# EAGLE design pedalier (EAGLE 6.5.0)

## Sheet 1 of 5
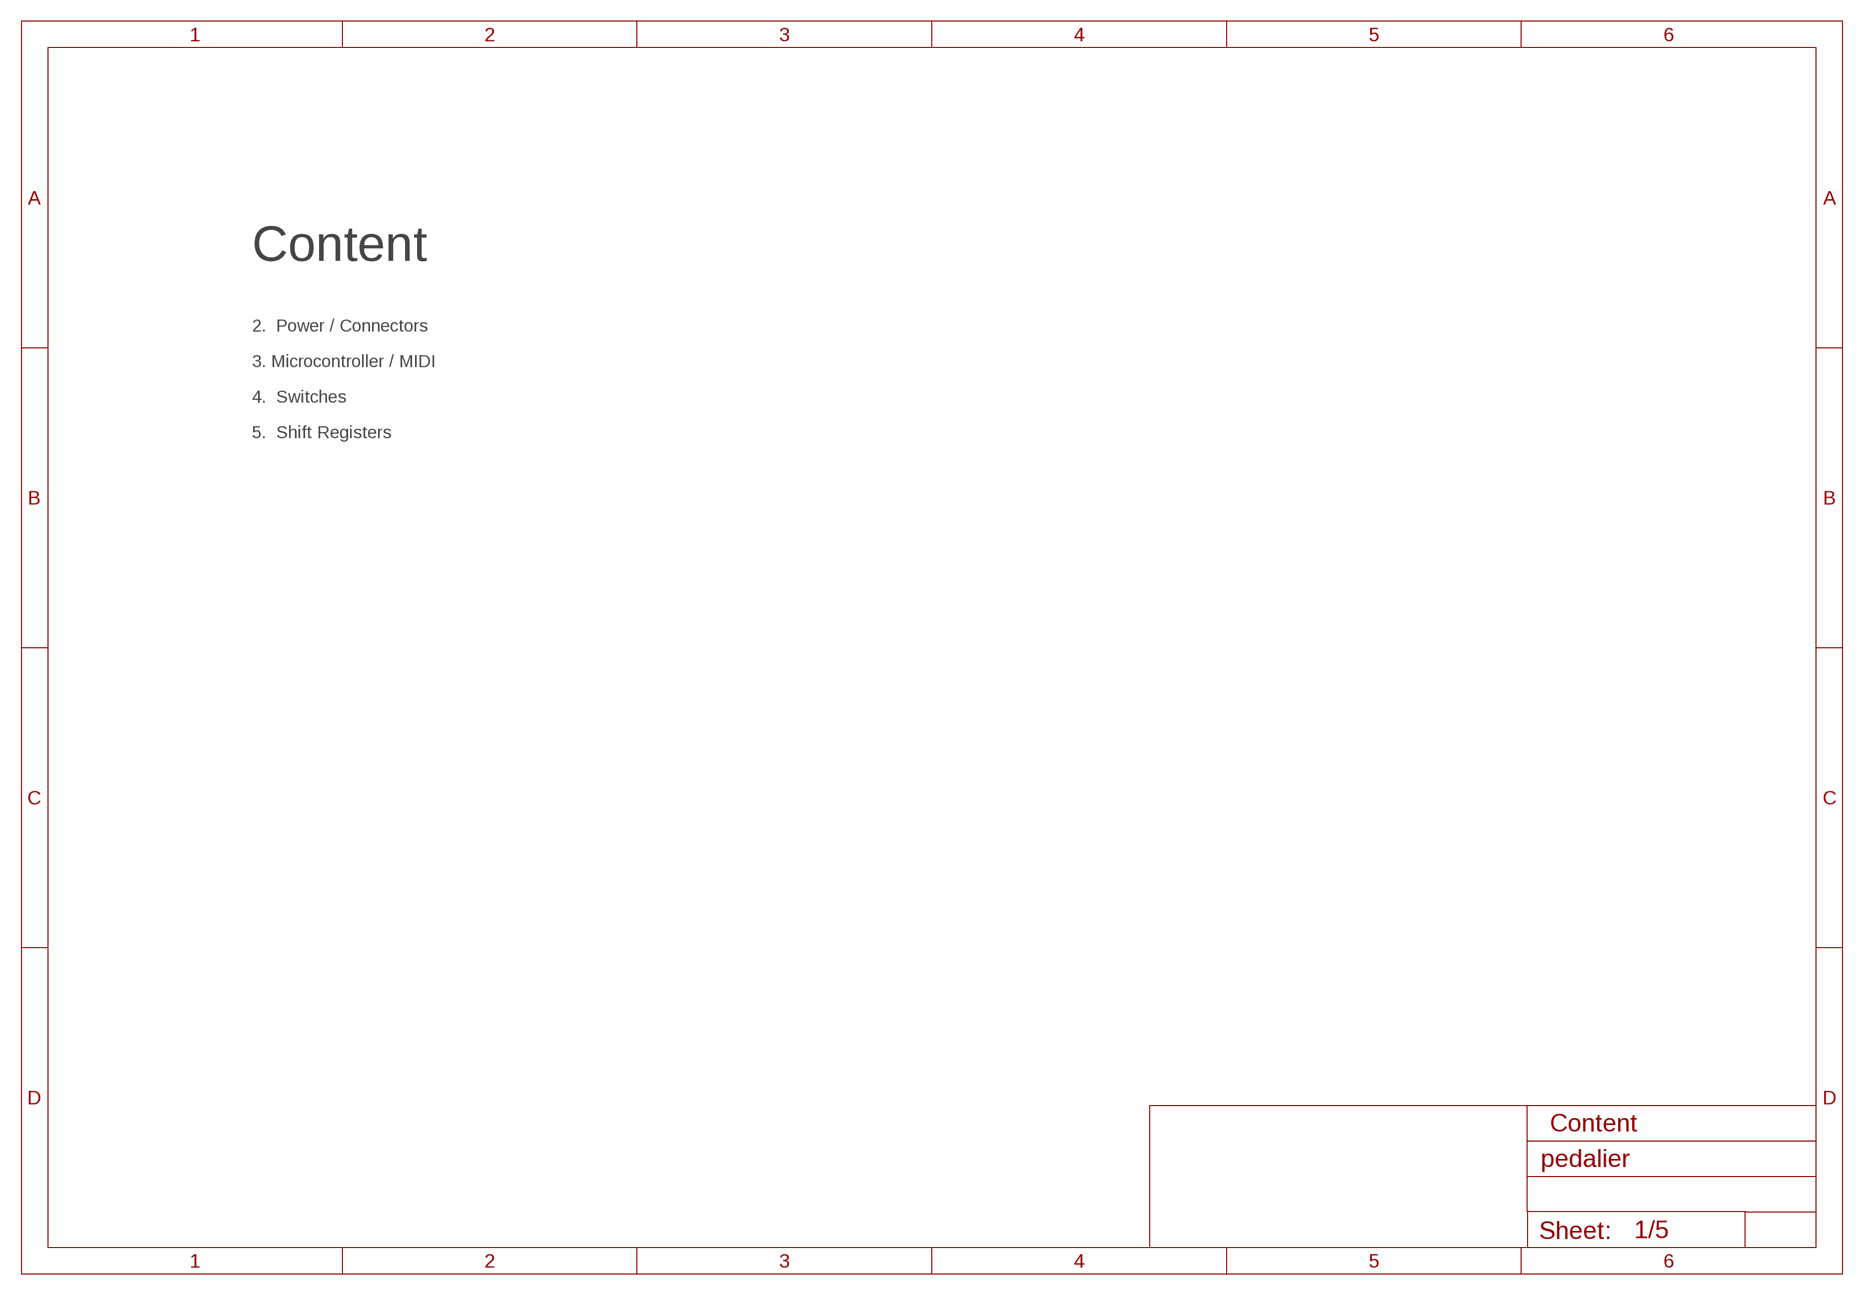
[diagram p0: schematic, sheet 1]

### Notes on the sheet
- Content
- 2.  Power / Connectors
- 3. Microcontroller / MIDI
- 4.  Switches
- 5.  Shift Registers
- Content

## Sheet 2 of 5
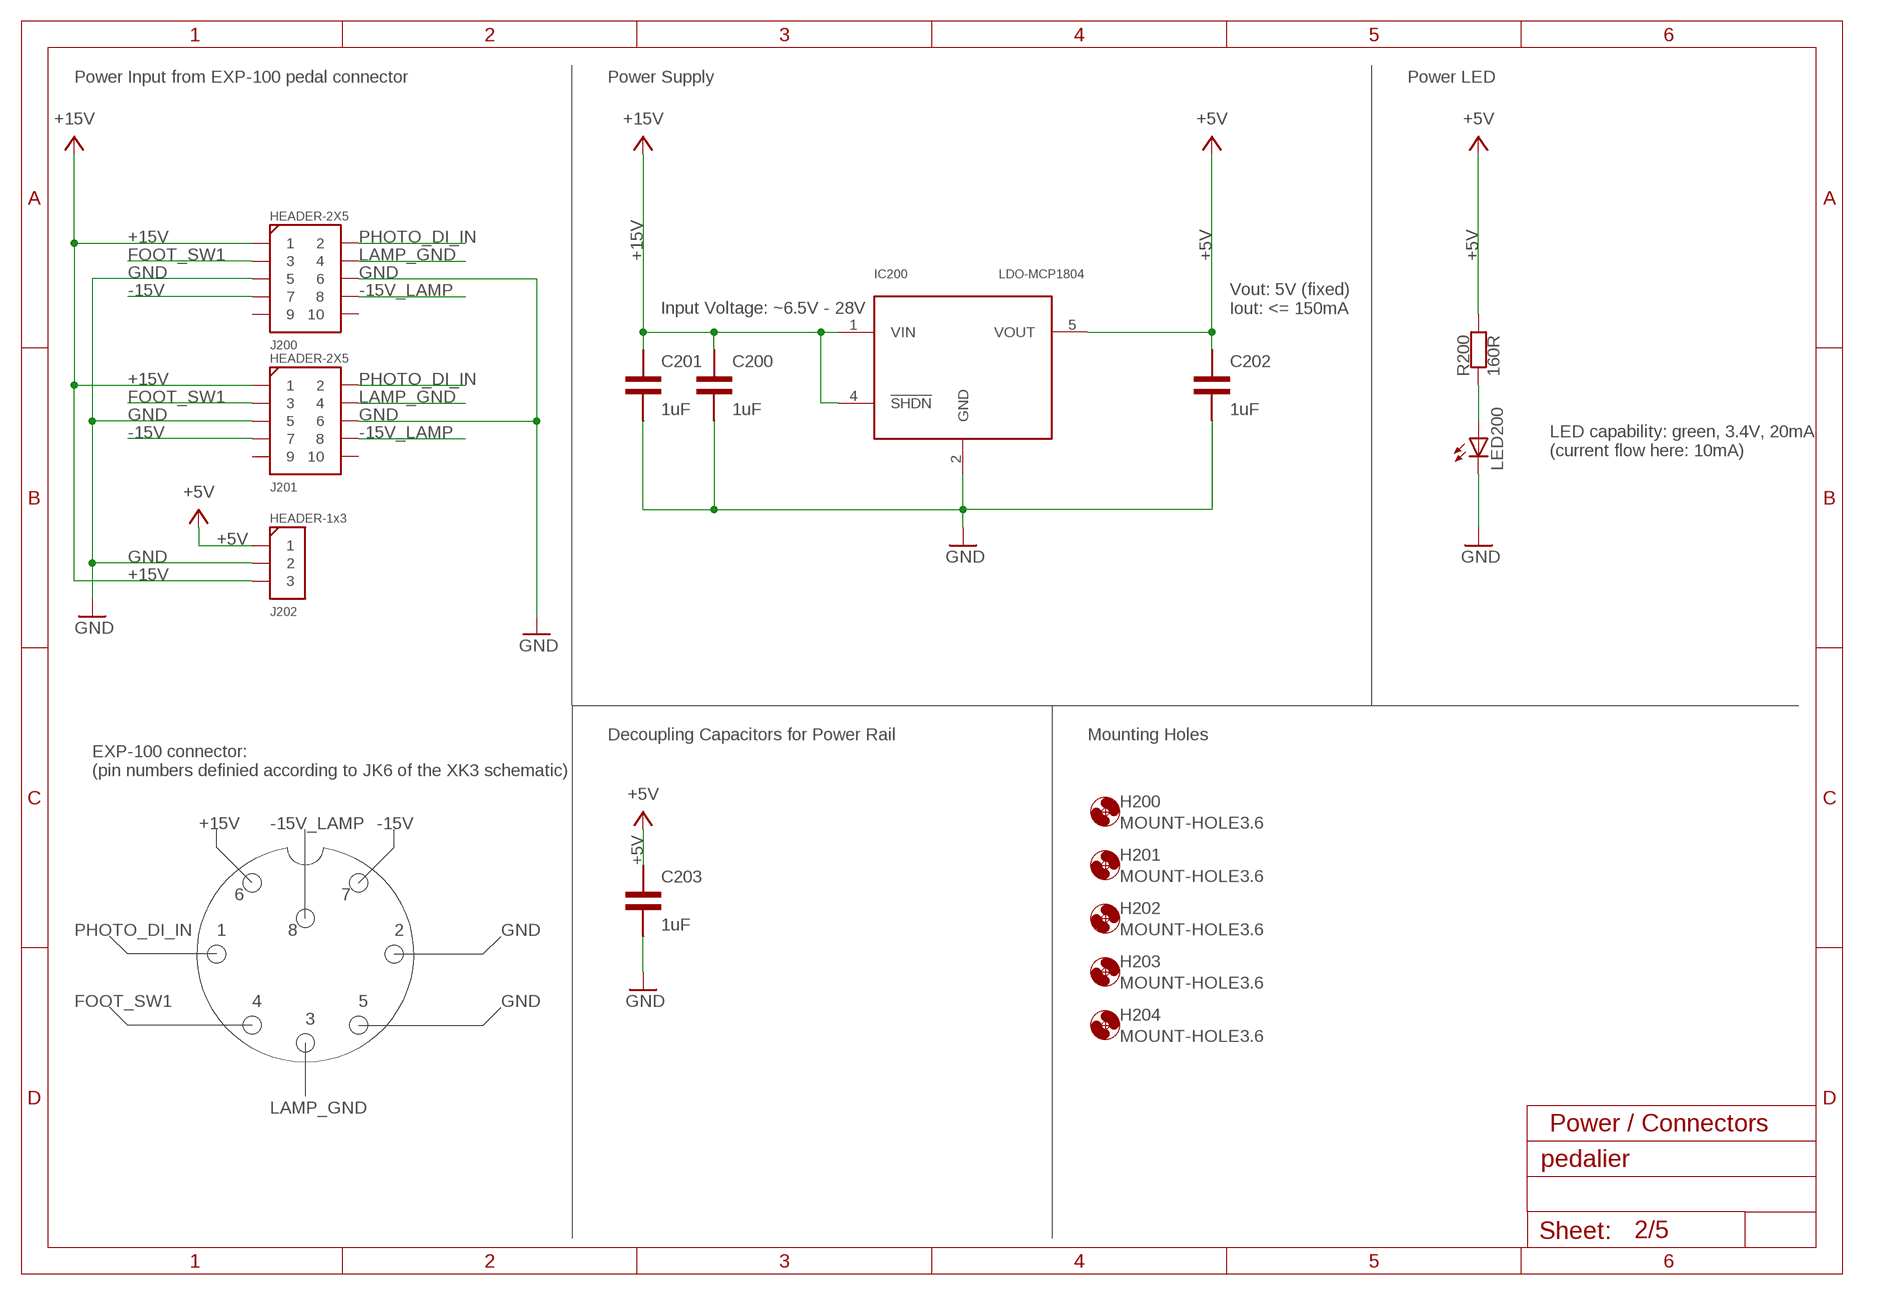
[diagram p1: schematic, sheet 2]

### Parts
C200  1uF  C  [C1206]
C201  1uF  C  [C1206]
C202  1uF  C  [C1206]
C203  1uF  C  [C1206]
H200  MOUNT-HOLE3.6  [3,6]
H201  MOUNT-HOLE3.6  [3,6]
H202  MOUNT-HOLE3.6  [3,6]
H203  MOUNT-HOLE3.6  [3,6]
H204  MOUNT-HOLE3.6  [3,6]
IC200  LDO-MCP1804  [SOT23-5]
J200  HEADER-2X5  [HEADER-2X5]
J201  HEADER-2X5  [HEADER-2X5]
J202  HEADER-1X3  [HEADER-1X3]
LED200  LED-BRIGHTEK  [LED1206]
R200  160R  R  [R1206]

### Nets
+5V: C202.1 C203.1 IC200.5(VOUT) J202.P$1 R200.2 ; also sheet 3,4,5
+15V [power2]: C200.1 C201.1 IC200.1(VIN) IC200.4(!SHDN) J200.P$1 J201.P$1 J202.P$3
-15V: J200.P$7 J201.P$7
-15V_LAMP: J200.P$8 J201.P$8
FOOT_SW1: J200.P$3 J201.P$3
GND: C200.2 C201.2 C202.2 C203.2 IC200.2(GND) J200.P$5 J200.P$6 J201.P$5 J201.P$6 J202.P$2 LED200.P$1(C) ; also sheet 3,4,5
LAMP_GND: J200.P$4 J201.P$4
N$1: LED200.P$2(A) R200.1
PHOTO_DI_IN: J200.P$2 J201.P$2
Unconnected: J200.P$9 J200.P$10 J201.P$9 J201.P$10

### Notes on the sheet
- Power Input from EXP-100 pedal connector | Power Supply | Power LED
- Input Voltage: ~6.5V - 28V
- Vout: 5V (fixed)
  Iout: <= 150mA
- LED capability: green, 3.4V, 20mA
  (current flow here: 10mA)
- Decoupling Capacitors for Power Rail | Mounting Holes
- EXP-100 connector:
  (pin numbers definied according to JK6 of the XK3 schematic)
- +15V | -15V_LAMP | -15V
- 6 | 7
- PHOTO_DI_IN | 1 | 8 | 2 | GND
- FOOT_SW1 | 4 | 5 | GND
- 3
- LAMP_GND
- Power / Connectors

## Sheet 3 of 5
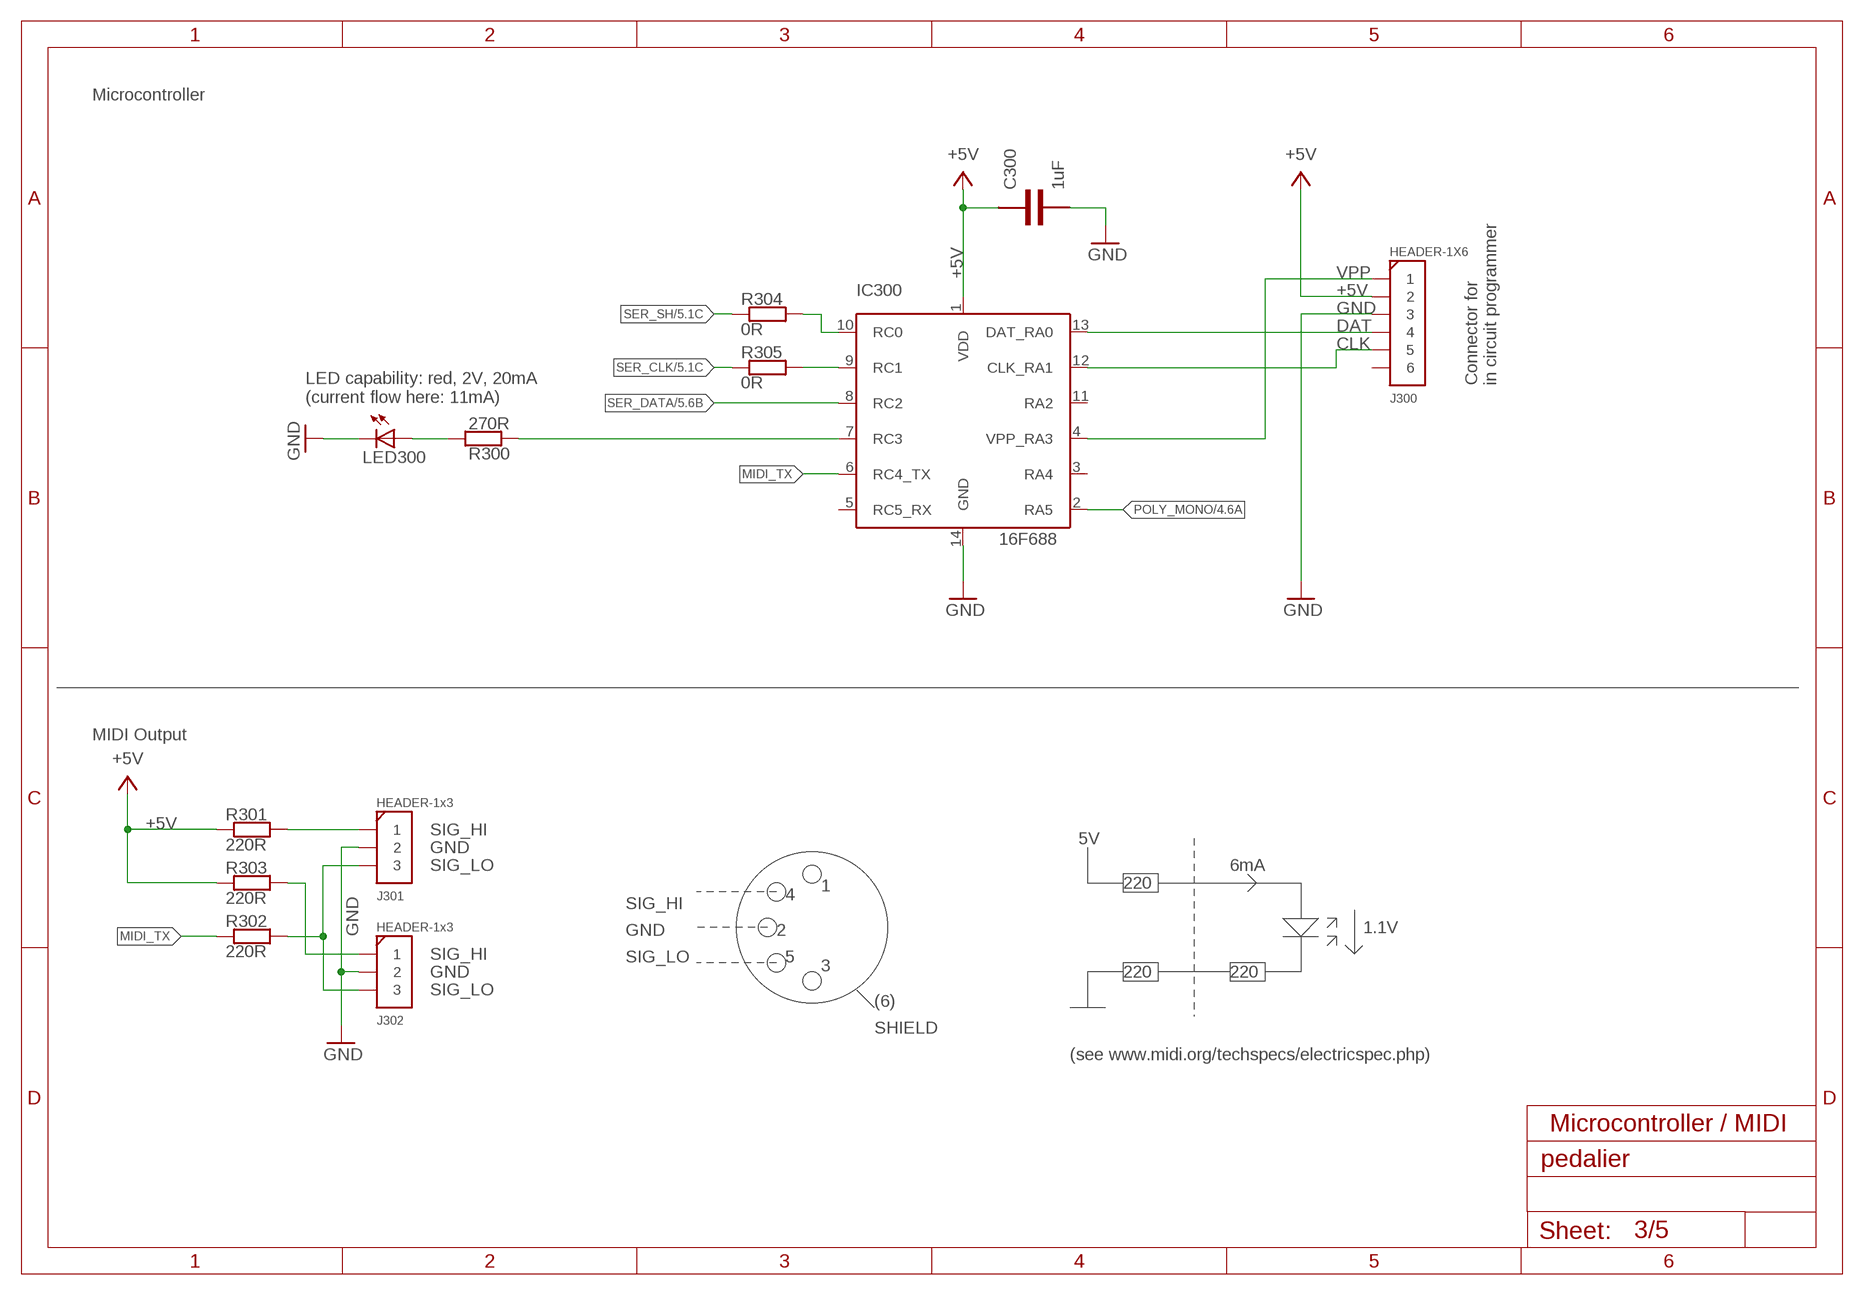
[diagram p2: schematic, sheet 3]

### Parts
C300  1uF  C  [C1206]
IC300  PIC16F688SOIC14  [SO14]
J300  HEADER-1X6  [HEADER-1X6]
J301  HEADER-1X3  [HEADER-1X3]
J302  HEADER-1X3  [HEADER-1X3]
LED300  LED-BRIGHTEK  [LED1206]
R300  270R  R  [R1206]
R301  220R  R  [R1206]
R302  220R  R  [R1206]
R303  220R  R  [R1206]
R304  0R  R  [R1206]
R305  0R  R  [R1206]

### Nets
+5V: C300.1 IC300.1(VDD) J300.P$2 R301.1 R303.1 ; also sheet 2,4,5
CLK: IC300.12(CLK_RA1) J300.P$5
DAT: IC300.13(DAT_RA0) J300.P$4
GND: C300.2 IC300.14(GND) J300.P$3 J301.P$2 J302.P$2 LED300.P$1(C) ; also sheet 2,4,5
MIDI_TX: IC300.6(RC4_TX) R302.1
N$2: J302.P$1 R303.2
N$3: LED300.P$2(A) R300.2
N$4: IC300.7(RC3) R300.1
N$5: J301.P$3 J302.P$3 R302.2
N$6: J301.P$1 R301.2
N$10: IC300.10(RC0) R304.2
N$11: IC300.9(RC1) R305.2
POLY_MONO: IC300.2(RA5) ; also sheet 4
SER_CLK: R305.1 ; also sheet 5
SER_DATA: IC300.8(RC2) ; also sheet 5
SER_SH: R304.1 ; also sheet 5
VPP: IC300.4(VPP_RA3) J300.P$1
Unconnected: IC300.3(RA4) IC300.5(RC5_RX) IC300.11(RA2) J300.P$6

### Notes on the sheet
- Microcontroller
- Connector for 
  in circuit programmer
- LED capability: red, 2V, 20mA
  (current flow here: 11mA)
- MIDI Output
- SIG_HI
- 5V
- GND
- SIG_LO | 6mA
- 220
- 1
- 4
- SIG_HI
- 1.1V
- GND | 2
- SIG_HI
- SIG_LO | 5
- GND | 3 | 220 | 220
- SIG_LO
- (6)
- SHIELD
- (see www.midi.org/techspecs/electricspec.php)
- Microcontroller / MIDI

## Sheet 4 of 5
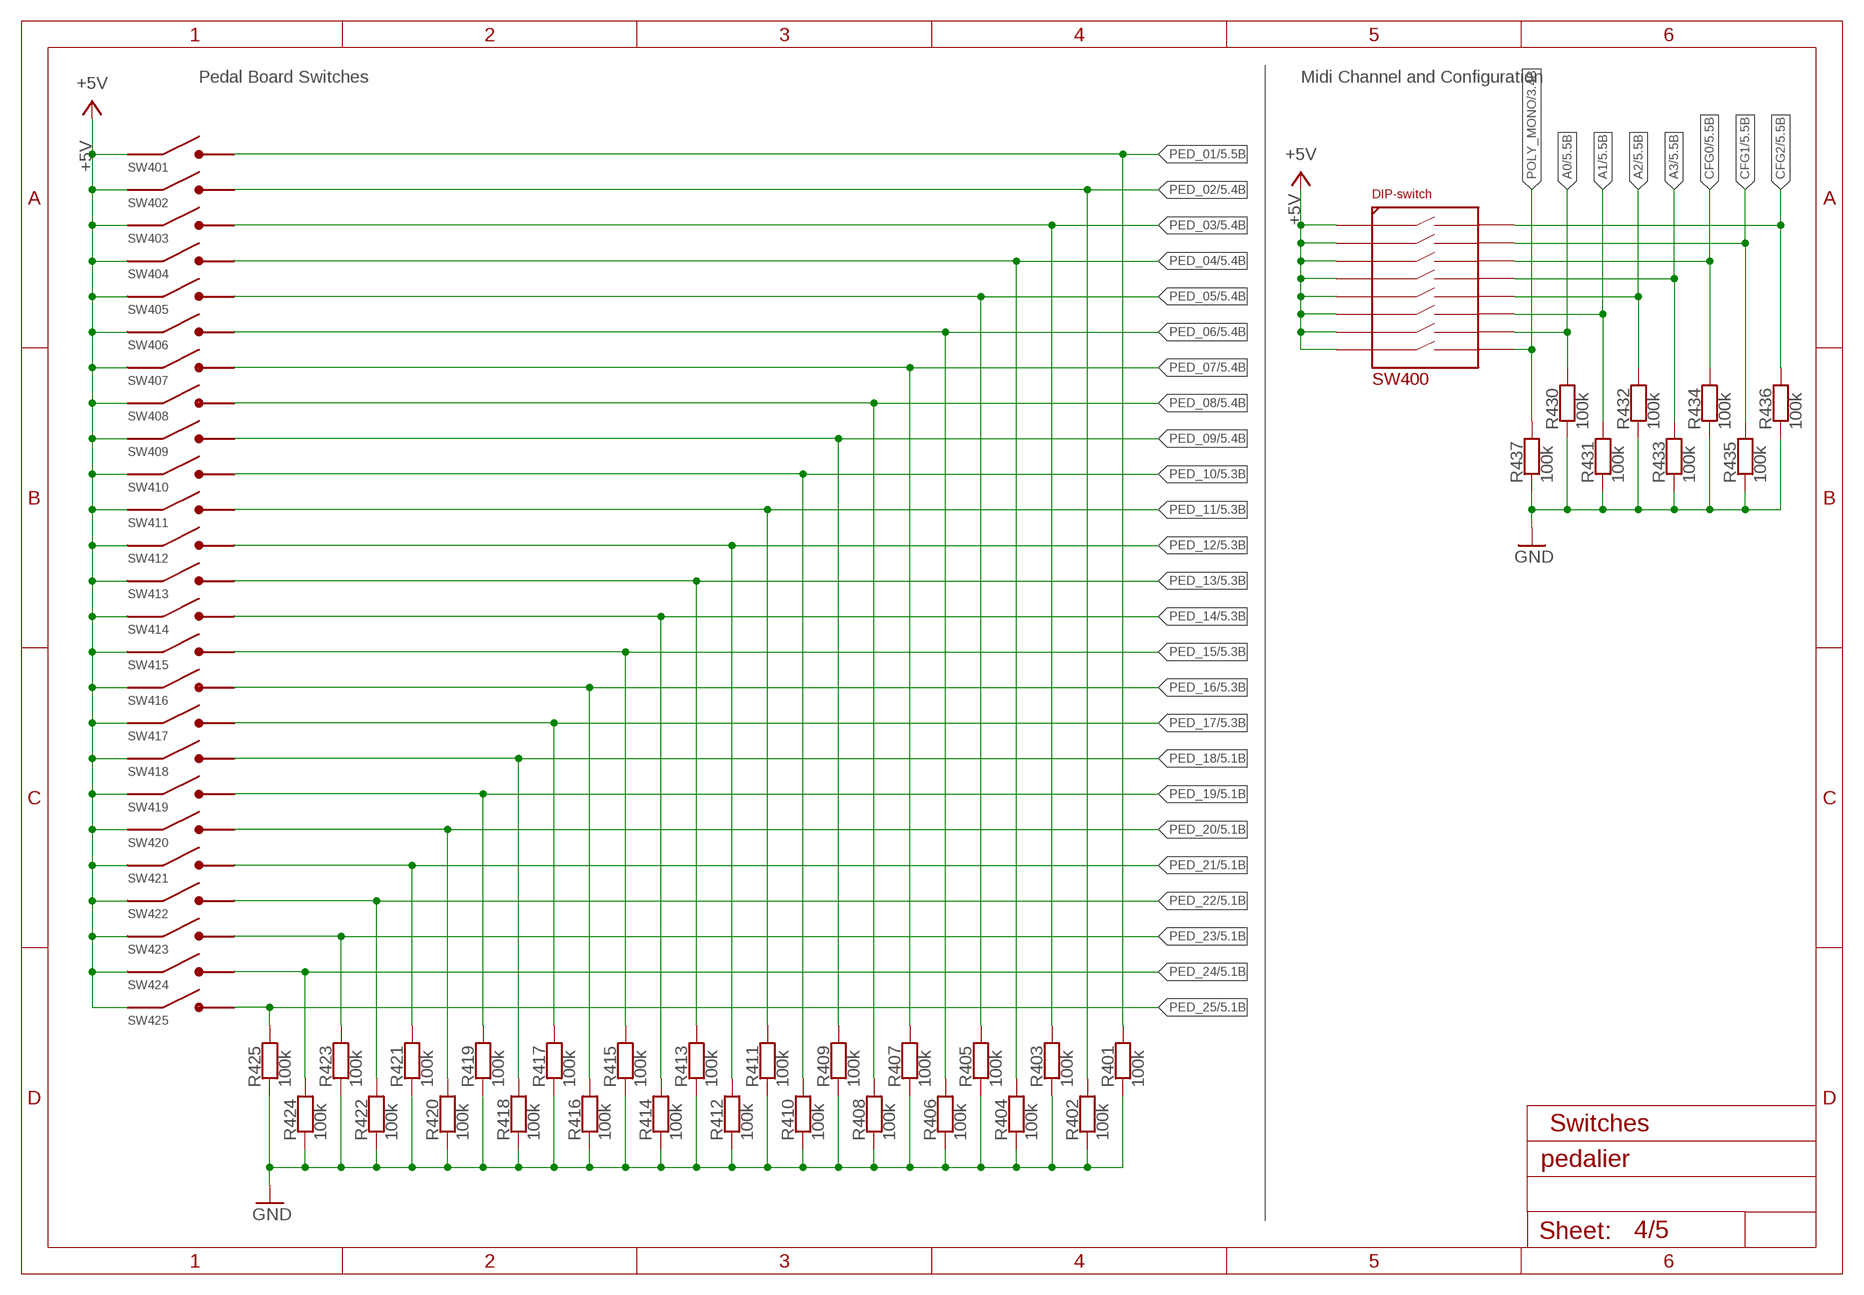
[diagram p3: schematic, sheet 4]

### Parts
R401  100k  R  [R1206]
R402  100k  R  [R1206]
R403  100k  R  [R1206]
R404  100k  R  [R1206]
R405  100k  R  [R1206]
R406  100k  R  [R1206]
R407  100k  R  [R1206]
R408  100k  R  [R1206]
R409  100k  R  [R1206]
R410  100k  R  [R1206]
R411  100k  R  [R1206]
R412  100k  R  [R1206]
R413  100k  R  [R1206]
R414  100k  R  [R1206]
R415  100k  R  [R1206]
R416  100k  R  [R1206]
R417  100k  R  [R1206]
R418  100k  R  [R1206]
R419  100k  R  [R1206]
R420  100k  R  [R1206]
R421  100k  R  [R1206]
R422  100k  R  [R1206]
R423  100k  R  [R1206]
R424  100k  R  [R1206]
R425  100k  R  [R1206]
R430  100k  R  [R1206]
R431  100k  R  [R1206]
R432  100k  R  [R1206]
R433  100k  R  [R1206]
R434  100k  R  [R1206]
R435  100k  R  [R1206]
R436  100k  R  [R1206]
R437  100k  R  [R1206]
SW400  DIP-SW-8X  [DIP-SW-8X-GULLWING]
SW401  REED-SW  [KSK-1A35-SMD]
SW402  REED-SW  [KSK-1A35-SMD]
SW403  REED-SW  [KSK-1A35-SMD]
SW404  REED-SW  [KSK-1A35-SMD]
SW405  REED-SW  [KSK-1A35-SMD]
SW406  REED-SW  [KSK-1A35-SMD]
SW407  REED-SW  [KSK-1A35-SMD]
SW408  REED-SW  [KSK-1A35-SMD]
SW409  REED-SW  [KSK-1A35-SMD]
SW410  REED-SW  [KSK-1A35-SMD]
SW411  REED-SW  [KSK-1A35-SMD]
SW412  REED-SW  [KSK-1A35-SMD]
SW413  REED-SW  [KSK-1A35-SMD]
SW414  REED-SW  [KSK-1A35-SMD]
SW415  REED-SW  [KSK-1A35-SMD]
SW416  REED-SW  [KSK-1A35-SMD]
SW417  REED-SW  [KSK-1A35-SMD]
SW418  REED-SW  [KSK-1A35-SMD]
SW419  REED-SW  [KSK-1A35-SMD]
SW420  REED-SW  [KSK-1A35-SMD]
SW421  REED-SW  [KSK-1A35-SMD]
SW422  REED-SW  [KSK-1A35-SMD]
SW423  REED-SW  [KSK-1A35-SMD]
SW424  REED-SW  [KSK-1A35-SMD]
SW425  REED-SW  [KSK-1A35-SMD]

### Nets
+5V: SW400.P$1 SW400.P$3 SW400.P$5 SW400.P$7 SW400.P$9 SW400.P$11 SW400.P$13 SW400.P$15 SW401.1 SW402.1 SW403.1 SW404.1 SW405.1 SW406.1 SW407.1 SW408.1 SW409.1 SW410.1 SW411.1 SW412.1 SW413.1 SW414.1 SW415.1 SW416.1 SW417.1 SW418.1 SW419.1 SW420.1 SW421.1 SW422.1 SW423.1 SW424.1 SW425.1 ; also sheet 2,3,5
A0: R430.2 SW400.P$14 ; also sheet 5
A1: R431.2 SW400.P$12 ; also sheet 5
A2: R432.2 SW400.P$10 ; also sheet 5
A3: R433.2 SW400.P$8 ; also sheet 5
CFG0: R434.2 SW400.P$6 ; also sheet 5
CFG1: R435.2 SW400.P$4 ; also sheet 5
CFG2: R436.2 SW400.P$2 ; also sheet 5
GND: R401.1 R402.1 R403.1 R404.1 R405.1 R406.1 R407.1 R408.1 R409.1 R410.1 R411.1 R412.1 R413.1 R414.1 R415.1 R416.1 R417.1 R418.1 R419.1 R420.1 R421.1 R422.1 R423.1 R424.1 R425.1 R430.1 R431.1 R432.1 R433.1 R434.1 R435.1 R436.1 R437.1 ; also sheet 2,3,5
PED_01: R401.2 SW401.2 ; also sheet 5
PED_02: R402.2 SW402.2 ; also sheet 5
PED_03: R403.2 SW403.2 ; also sheet 5
PED_04: R404.2 SW404.2 ; also sheet 5
PED_05: R405.2 SW405.2 ; also sheet 5
PED_06: R406.2 SW406.2 ; also sheet 5
PED_07: R407.2 SW407.2 ; also sheet 5
PED_08: R408.2 SW408.2 ; also sheet 5
PED_09: R409.2 SW409.2 ; also sheet 5
PED_10: R410.2 SW410.2 ; also sheet 5
PED_11: R411.2 SW411.2 ; also sheet 5
PED_12: R412.2 SW412.2 ; also sheet 5
PED_13: R413.2 SW413.2 ; also sheet 5
PED_14: R414.2 SW414.2 ; also sheet 5
PED_15: R415.2 SW415.2 ; also sheet 5
PED_16: R416.2 SW416.2 ; also sheet 5
PED_17: R417.2 SW417.2 ; also sheet 5
PED_18: R418.2 SW418.2 ; also sheet 5
PED_19: R419.2 SW419.2 ; also sheet 5
PED_20: R420.2 SW420.2 ; also sheet 5
PED_21: R421.2 SW421.2 ; also sheet 5
PED_22: R422.2 SW422.2 ; also sheet 5
PED_23: R423.2 SW423.2 ; also sheet 5
PED_24: R424.2 SW424.2 ; also sheet 5
PED_25: R425.2 SW425.2 ; also sheet 5
POLY_MONO: R437.2 SW400.P$16 ; also sheet 3

### Notes on the sheet
- Pedal Board Switches | Midi Channel and Configuration
- Switches

## Sheet 5 of 5
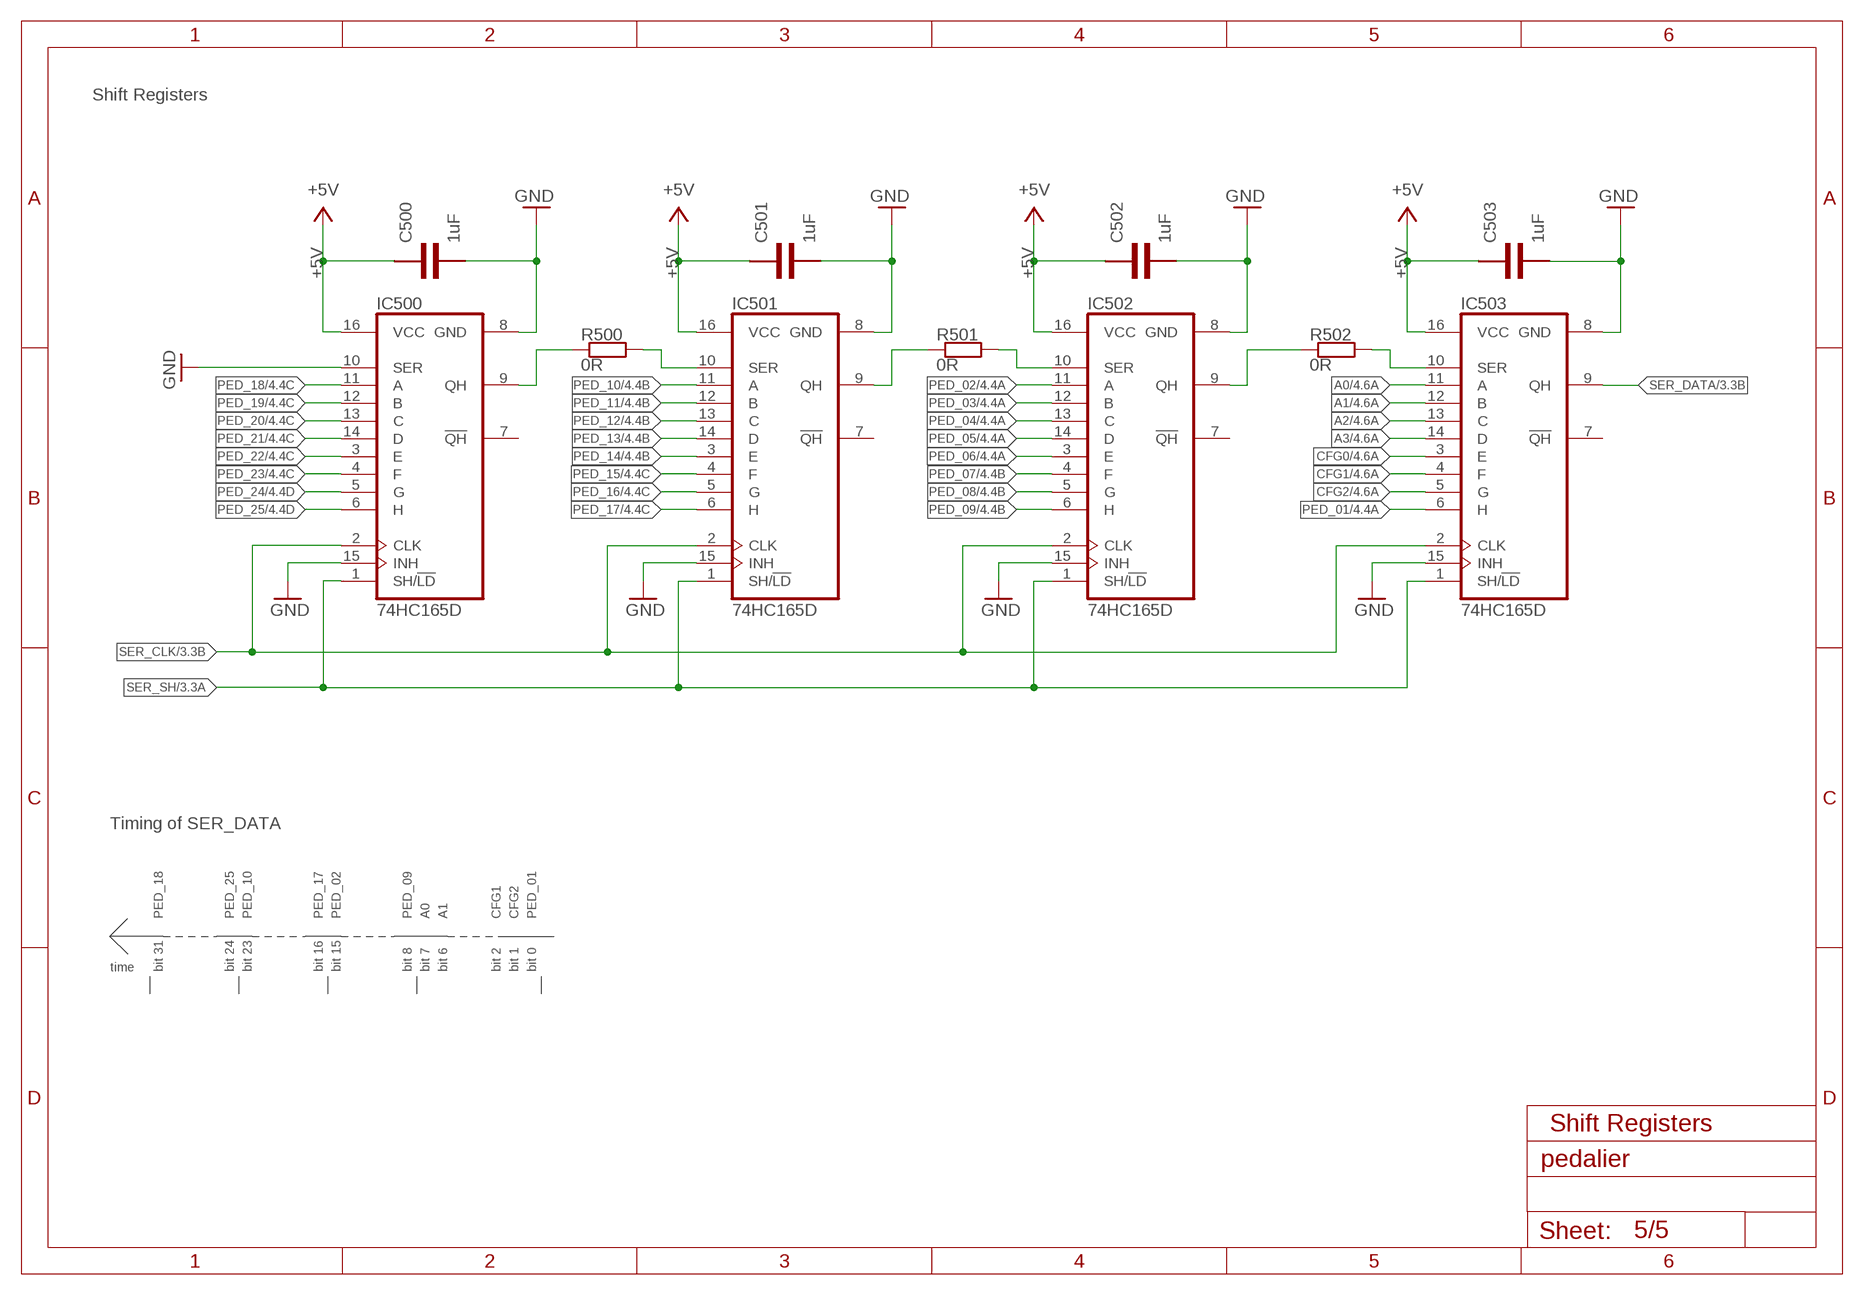
[diagram p4: schematic, sheet 5]

### Parts
C500  1uF  C  [C1206]
C501  1uF  C  [C1206]
C502  1uF  C  [C1206]
C503  1uF  C  [C1206]
IC500  74HC165D  [SO16]
IC501  74HC165D  [SO16]
IC502  74HC165D  [SO16]
IC503  74HC165D  [SO16]
R500  0R  R  [R1206]
R501  0R  R  [R1206]
R502  0R  R  [R1206]

### Nets
+5V: C500.1 C501.1 C502.1 C503.1 IC500.16(VCC) IC501.16(VCC) IC502.16(VCC) IC503.16(VCC) ; also sheet 2,3,4
A0: IC503.11(A) ; also sheet 4
A1: IC503.12(B) ; also sheet 4
A2: IC503.13(C) ; also sheet 4
A3: IC503.14(D) ; also sheet 4
CFG0: IC503.3(E) ; also sheet 4
CFG1: IC503.4(F) ; also sheet 4
CFG2: IC503.5(G) ; also sheet 4
GND: C500.2 C501.2 C502.2 C503.2 IC500.8(GND) IC500.10(SER) IC500.15(INH) IC501.8(GND) IC501.15(INH) IC502.8(GND) IC502.15(INH) IC503.8(GND) IC503.15(INH) ; also sheet 2,3,4
N$7: IC500.9(QH) R500.1
N$8: IC501.9(QH) R501.1
N$9: IC502.10(SER) R501.2
N$12: IC502.9(QH) R502.1
N$13: IC503.10(SER) R502.2
N$14: IC501.10(SER) R500.2
PED_01: IC503.6(H) ; also sheet 4
PED_02: IC502.11(A) ; also sheet 4
PED_03: IC502.12(B) ; also sheet 4
PED_04: IC502.13(C) ; also sheet 4
PED_05: IC502.14(D) ; also sheet 4
PED_06: IC502.3(E) ; also sheet 4
PED_07: IC502.4(F) ; also sheet 4
PED_08: IC502.5(G) ; also sheet 4
PED_09: IC502.6(H) ; also sheet 4
PED_10: IC501.11(A) ; also sheet 4
PED_11: IC501.12(B) ; also sheet 4
PED_12: IC501.13(C) ; also sheet 4
PED_13: IC501.14(D) ; also sheet 4
PED_14: IC501.3(E) ; also sheet 4
PED_15: IC501.4(F) ; also sheet 4
PED_16: IC501.5(G) ; also sheet 4
PED_17: IC501.6(H) ; also sheet 4
PED_18: IC500.11(A) ; also sheet 4
PED_19: IC500.12(B) ; also sheet 4
PED_20: IC500.13(C) ; also sheet 4
PED_21: IC500.14(D) ; also sheet 4
PED_22: IC500.3(E) ; also sheet 4
PED_23: IC500.4(F) ; also sheet 4
PED_24: IC500.5(G) ; also sheet 4
PED_25: IC500.6(H) ; also sheet 4
SER_CLK: IC500.2(CLK) IC501.2(CLK) IC502.2(CLK) IC503.2(CLK) ; also sheet 3
SER_DATA: IC503.9(QH) ; also sheet 3
SER_SH: IC500.1(SH/!LD) IC501.1(SH/!LD) IC502.1(SH/!LD) IC503.1(SH/!LD) ; also sheet 3
Unconnected: IC500.7(!QH) IC501.7(!QH) IC502.7(!QH) IC503.7(!QH)

### Notes on the sheet
- Shift Registers
- Timing of SER_DATA
- PED_18 | PED_25 | PED_10 | PED_17 | PED_02 | PED_09 | A0 | A1 | CFG1 | CFG2 | PED_01
- time | bit 31 | bit 24 | bit 23 | bit 16 | bit 15 | bit 8 | bit 7 | bit 6 | bit 2 | bit 1 | bit 0
- Shift Registers

## Library data of the parts
C200-C203 C300 C500-C503 = pedalier:C: Capacitor
H200-H204 = pedalier:MOUNT-HOLE: MOUNTING HOLE with drill center marker
IC200 = pedalier:LDO-MCP1804: MCP1804 150-mA Low-Dropout Regulator, 5V fixed, SOT23-5, MCP1804T-5002I/OT Digikey (SOT23-5): MCP1804T-5002I/OTCT-ND
IC300 = pedalier:PIC16F688: PIC16F688
IC500-IC503 = pedalier:74HC165: 8-bit parallel load SHIFT REGISTER
J200 J201 = pedalier:HEADER-2X5: Header 2x5 Manufacturer: FCI Product nr: 54202-G0805LF Digikey: 609-4723-ND
J202 J301 J302 = pedalier:HEADER-1X3: Header-1x3 1x3 header with lock Digikey: WM7203-ND
J300 = pedalier:HEADER-1X6: Header 1x6 Manufacturer: 3M Product Nr: 961106-6300-AR-PR Digikey: 3M9488CT-ND
LED200 LED300 = pedalier:LED-BRIGHTEK: LED Digikey: 1516-1172-1-ND
R200 R300-R305 R401-R425 R430-R437 R500-R502 = pedalier:R: Resistor
SW400 = pedalier:DIP-SW-8X: 8x DIP Switch (half pitch) Digikey: CT2188LPST-ND
SW401-SW425 = pedalier:REED-SW: REED Switch Series: KSK-1A35 Digikey: 374-1318-ND

## Net classes
0 default: width 0.2 mm, drill 0.3 mm, clearance 0.2 mm
1 power: width 0.3 mm, drill 0.3 mm, clearance 0.2 mm to class 0, clearance 0.2 mm
2 power2: width 0.5 mm, drill 0.3 mm, clearance 0.2 mm to class 0, clearance 0.2 mm to class 1, clearance 0.2 mm

## Board
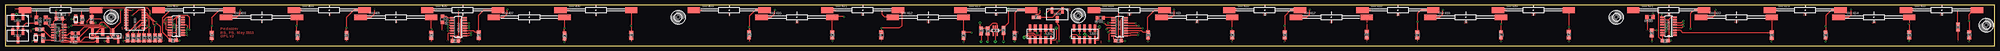
[diagram p5: board, top side]
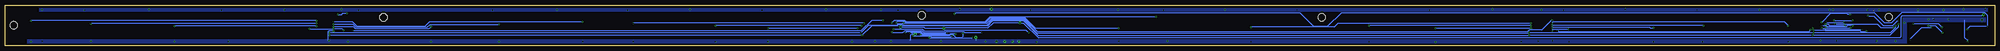
[diagram p6: board, bottom side, seen from below]

Size 970 x 20 mm. Coordinates in mm from the lower left corner, seen from the top.
Outline: 0,0 970,0 970,20 0,20 0,0
Copper layers (1*16): Top 0.035mm / dielectric 1.5mm / Bottom 0.035mm
Design rules "default *": minimum track width 0.2mm, minimum drill 0.3mm, track to track 0.2mm, track to pad 0.2mm, pad to pad 0.2mm, via to via 0.2mm, smd to smd 0.2mm, copper to edge 40mil, drill to drill 0.2mm, minimum pad ring 0.2mm, minimum via ring 0.2mm, stop-mask expansion 4mil, vias tented up to drill 0mil, thermal gap 10mil
tKeepout: area 0,0 to 970,1; area 0,1 to 1,19; area 969,1 to 970,19; area 0,19 to 970,20

### Footprints (pad centres in the part's own frame; a part is rotated, then mirrored left to right if it is on the bottom)
C1206 = smd 1.6 x 1.8: 1 -1.4,0; 2 1.4,0
3,6 = hole 3.6: 0,0
SOT23-5 = smd 0.6 x 1.8: 1 -0.95,-1.706; 2 0,-1.706; 3 0.95,-1.706; 4 0.95,1.706; 5 -0.95,1.706
SO14 = smd 0.6 x 2.2: 1 -3.81,-2.6; 2 -2.54,-2.6; 3 -1.27,-2.6; 4 0,-2.6; 5 1.27,-2.6; 6 2.54,-2.6; 7 3.81,-2.6; 8 3.81,2.6; 9 2.54,2.6; 10 1.27,2.6; 11 0,2.6; 12 -1.27,2.6; 13 -2.54,2.6; 14 -3.81,2.6
SO16 = smd 0.66 x 2.032: 1 -4.445,-3.073; 2 -3.175,-3.073; 3 -1.905,-3.073; 4 -0.635,-3.073; 5 0.635,-3.073; 6 1.905,-3.073; 7 3.175,-3.073; 8 4.445,-3.073; 9 4.445,3.073; 10 3.175,3.073; 11 1.905,3.073; 12 0.635,3.073; 13 -0.635,3.073; 14 -1.905,3.073; 15 -3.175,3.073; 16 -4.445,3.073
HEADER-2X5 = smd 1.27 x 3.6: P$1 -5.08,2.94; P$2 -5.08,-2.94; P$3 -2.54,2.94; P$4 -2.54,-2.94; P$5 0,2.94; P$6 0,-2.94; P$7 2.54,2.94; P$8 2.54,-2.94; P$9 5.08,2.94; P$10 5.08,-2.94
HEADER-1X3 = smd 1.27 x 3.18: P$1 2.54,2.1; P$2 0,-2.1; P$3 -2.54,2.1
HEADER-1X6 = smd 1.27 x 3.6: P$1 -6.35,1.8; P$2 -3.81,-1.8; P$3 -1.27,1.8; P$4 1.27,-1.8; P$5 3.81,1.8; P$6 6.35,-1.8
LED1206 = smd 1.5 x 1.5: P$1 -1.5,0; P$2 1.5,0
R1206 = smd 1.6 x 1.803: 1 -1.422,0; 2 1.422,0
DIP-SW-8X-GULLWING = smd 0.76 x 2: P$1 -4.445,4.22; P$2 -4.445,-4.22; P$3 -3.175,4.22; P$4 -3.175,-4.22; P$5 -1.905,4.22; P$6 -1.905,-4.22; P$7 -0.635,4.22; P$8 -0.635,-4.22; P$9 0.635,4.22; P$10 0.635,-4.22; P$11 1.905,4.22; P$12 1.905,-4.22; P$13 3.175,4.22; P$14 3.175,-4.22; P$15 4.445,4.22; P$16 4.445,-4.22
KSK-1A35-SMD = smd 6 x 2.7: 1 -17.25,0; 2 17.25,0

### Placement (x,y rotation side)
C200  475.75,7.35 270 top
C201  479,7.25 270 top
C202  486.65,7.6 270 top
C203  951.95,9.15 270 top
C300  26.4,13.4 0 top
C500  809.25,2.45 0 top
C501  542.7,2.55 0 top
C502  219.45,2.35 0 top
C503  81.85,2.7 0 top
H200  51.75,14.05 0 top
H201  328.1,14 0 top
H202  523.1,14.9 0 top
H203  785.5,14 0 top
H204  965.85,10.1 0 top
IC200  482.65,7.45 180 top
IC300  26.2,6.5 270 top
IC500  810.9,9.6 90 top
IC501  543.3,9.3 90 top
IC502  221,9.25 90 top
IC503  83.4,9.6 90 top
J200  526.25,5.8 180 top
J201  504.75,5.8 180 top
J202  6.25,12 0 top
J300  48.85,4.9 180 top
J301  512.9,15.2 0 top
J302  6.25,4.75 0 top
LED200  34.45,12.95 270 top
LED300  15,3.8 90 top
R200  37.45,12.85 90 top
R300  18.45,3.75 90 top
R301  502.65,13.9 0 top
R302  16.8,8.15 180 top
R303  15.3,12.55 270 top
R304  34.2,6.2 180 top
R305  34.25,3.5 180 top
R401  42.2,12.85 90 top
R402  100.75,5.05 90 top
R403  142.5,5.15 90 top
R404  166.4,5.05 90 top
R405  207.75,5.15 90 top
R406  230.9,5.2 90 top
R407  272.65,4.8 90 top
R408  305.25,5.15 90 top
R409  362.7,5.35 90 top
R410  403.25,5.25 90 top
R411  427.15,5.25 90 top
R412  467.25,5 90 top
R413  492.1,5 90 top
R414  557.1,5.25 90 top
R415  598.25,5.25 90 top
R416  623.8,5.3 90 top
R417  663.75,5.45 90 top
R418  688.45,5.25 90 top
R419  729.2,5.35 90 top
R420  762.25,5.45 90 top
R421  802.75,6.25 90 top
R422  861.25,5.2 90 top
R423  887.5,5.3 90 top
R424  928.25,5.3 90 top
R425  957.5,5.35 90 top
R430  75.55,3.9 90 top
R431  73,3.9 90 top
R432  70.3,3.85 90 top
R433  59.7,3.8 90 top
R434  62.5,3.8 90 top
R435  65.1,3.8 90 top
R436  67.65,3.85 90 top
R437  19.8,12.6 270 top
R500  801.9,14.05 180 top
R501  533.9,13.75 180 top
R502  213.25,13 270 top
SW400  63.35,13.15 90 top
SW401  27,17.5 0 top
SW402  92,17.5 0 top
SW403  125,14 0 top
SW404  158,17.5 0 top
SW405  190.5,14 0 top
SW406  223,17.5 0 top
SW407  255.5,14 0 top
SW408  288,17.5 0 top
SW409  353,17.5 0 top
SW410  386,14 0 top
SW411  418,17.5 0 top
SW412  450,14 0 top
SW413  483,17.5 0 top
SW414  548,17.5 0 top
SW415  581,14 0 top
SW416  614,17.5 0 top
SW417  646.5,14 0 top
SW418  679,17.5 0 top
SW419  712,14 0 top
SW420  745,17.5 0 top
SW421  811,17.5 0 top
SW422  844,14 0 top
SW423  877.5,17.5 0 top
SW424  911,14 0 top
SW425  944,17.5 0 top

### Tracks (layer width: path | path; a pad name or v marks a point on that pad's centre or on a via)
+5V  (via drill 0.3, 0.6 pad 1.27)  (1 unrouted)
  Top 0.2: R303.1 v15.3,17.8 | J202.P$1 8.79,16.54 SW401.1 9.35,17.9 v4.7,17.9 | IC300.1 23.7,10.41 23.7,12 24.6,12.9 24.6,13 C300.1 v25,17.7 | J300.P$2 52.7,6.74 52.7,7.9 56.4,11.6 v56.4,17.7 | R200.2 37.45,17.65 v37.4,17.7 | SW400.P$1 SW400.P$3 SW400.P$5 SW400.P$7 SW400.P$9 SW400.P$11 SW400.P$13 59.1,16.32 59.1,17.6 | SW402.1 74.85,17.6 v78.9,17.6 | 80.45,5.03 IC503.16 80.33,2.82 C503.1 80.45,2.85 76.8,6.5 76.8,13.8 v80.6,17.6 | SW403.1 112.8,14 114.7,15.9 v114.7,17.7 | SW404.1 v145.2,17.5 | SW405.1 178.4,14 180.2,15.8 v180.2,17.8 | SW406.1 v210.2,17.5 | SW407.1 243,14 244.9,15.9 v244.9,17.8 | SW408.1 v275.6,17.5 | SW409.1 v340.2,17.5 | SW410.1 373.5,14 375.3,15.8 v375.3,17.7 | C502.1 217.93,2.47 IC502.16 220.6,4.8 221.1,5.3 v221.1,17.7 | SW411.1 v405.3,17.5 | SW412.1 428.8,14 427.5,15.3 v427.5,17.7 | SW413.1 v470.1,17.5 | v543,17.6 543,4.3 541.9,3.2 541.9,3.15 C501.1 540.23,3.62 IC501.16 | R301.1 501.23,14.03 502.7,15.5 503.8,15.5 504.6,16.3 v504.6,17.8 | SW414.1 v534.8,17.5 | SW415.1 568.7,14 569.9,15.2 v569.9,17.8 | SW416.1 v601.1,17.5 | SW417.1 634.5,14 636.1,15.6 v636.1,17.8 | SW418.1 v666.5,17.5 | SW419.1 699.3,14 700.9,15.6 v700.9,17.7 | SW420.1 v732.4,17.5 | SW421.1 v797.8,17.5 | SW422.1 832.4,14 833.7,15.3 v833.7,17.7 | SW423.1 v864.6,17.5 | SW424.1 898.8,14 899.9,15.1 899.9,17.7 v899.8,17.8 | SW425.1 v931.2,17.5 | C500.1 807.5,2.8 | 807.5,2.8 806.1,4.2 v806.1,17.8 | IC500.16 807.83,3.13 807.5,2.8 | C203.1 951.95,17.65 v952,17.7 | SW400.P$15 61.9,17.59 61.9,17.6 v62,17.6
  Top 0.5: IC200.5 483.6,6.4 484.7,7.5 485.15,7.5 C202.1 486.7,9 489.2,11.5 v489.2,18
  Bottom 0.2: v489.2,18 489.9,18 | v15.3,17.8 15.7,17.8 | v4.7,17.9 4.5,17.9 | v25,17.7 24.7,17.7 | v56.4,17.7 56.1,17.7
  pour Bottom: 3.5,18.9 953.3,18.9 953.3,16.9 3.5,16.9
+15V  (via drill 0.6 pad 1.27)
  Top 0.5: J202.P$3 3.71,14.91 4.1,15.3 v5.5,15.3 | J200.P$1 531.3,2.89 533.09,2.89 533.5,3.3 v533.5,9.2 | J201.P$1 511.86,2.86 512.4,3.4 v512.4,8.7 | v475.3,11.2 475.3,9.2 C200.1 475.85,8.65 C201.1 | C201.1 480.35,7.3 480.7,7.3 481.7,6.3 IC200.4 | IC200.1 483.6,10.6 483.3,10.9 481.25,10.9 C201.1
  Bottom 0.5: v5.5,15.3 5.9,15.3 6.7,14.5 45.3,14.5 45.9,13.9 45.9,4.3 46.4,3.8 466.2,3.8 473.6,11.2 v475.3,11.2 488.4,11.2 490.9,8.7 v512.4,8.7 521.7,8.7 522.1,9.1 533.4,9.1 v533.5,9.2
-15V  (via drill 0.3)
  Top 0.2: J201.P$7 502.21,3.99 501,5.2 499.3,5.2 499,5.2 498.9,5.2 498.3,4.6 v498.3,4.1 | J200.P$7 523.3,3.27 523.3,4.4 522.3,5.4 520.2,5.4 519.3,4.5 v519.3,3.9
  Bottom 0.2: v519.3,3.9 519,3.6 498.8,3.6 v498.3,4.1
-15V_LAMP  (via drill 0.3)
  Top 0.2: J200.P$8 v523.71,5.41 v523.7,5.4 | v503,6.2 503,6.8 502.6,7.2 502.6,8.35 J201.P$8
  Bottom 0.2: v523.7,5.4 523.4,5.1 509.4,5.1 508.9,5.6 508.1,5.6 506.6,4.1 503.6,4.1 503,4.7 v503,6.2
A0  (via drill 0.3)
  Top 0.2: SW400.P$14 68.88,16.32 69.3,15.9 69.3,15.6 v73.45,11.45 75.55,9.35 R430.2 | IC503.11 v82.19,11.51 v82.2,11.5
  Bottom 0.2: v82.2,11.5 82.1,11.4 73.5,11.4 v73.45,11.45
A1  (via drill 0.3)
  Top 0.2: R431.2 v73,10 72.3,10.7 72.3,11.8 69.05,15.05 SW400.P$12 | IC503.12 82.23,10.23 v82.6,10.6
  Bottom 0.2: v73,10 80.7,10 81.3,10.6 v82.6,10.6
A2  (via drill 0.3)
  Top 0.2: R432.2 v70.3,8.8 70.3,12.8 69.31,13.79 SW400.P$10 | IC503.13 82.27,8.96 v82.3,9
  Bottom 0.2: v82.3,9 82.1,8.8 v70.3,8.8
A3  (via drill 0.3)
  Top 0.2: IC503.14 78.81,7.7 78.5,8 v78.5,12.5 | 67.56,12.5 SW400.P$8 | SW400.P$8 66.99,12.52 67.01,12.5 v69.5,12.5 | R433.2 59.7,6.4 65.81,12.52 SW400.P$8
  Bottom 0.2: v78.5,12.5 v69.5,12.5
CFG0  (via drill 0.3)
  Top 0.2: R434.2 v62.5,7.1 66.64,11.24 SW400.P$6 | IC503.3 v88.5,7.7
  Bottom 0.2: v88.5,7.7 82.9,7.7 82.7,7.5 65.8,7.5 65.4,7.1 v62.5,7.1
CFG1  (via drill 0.3)
  Top 0.2: R435.2 v65.1,8 65.1,8.9 66.15,9.95 67.55,9.95 SW400.P$4 | IC503.4 84.77,8.96 v84.3,8.5
  Bottom 0.2: v84.3,8.5 82.9,8.5 82.4,8 v65.1,8
CFG2  (via drill 0.3)
  Top 0.2: v89,8.7 89,9.6 88.36,10.23 IC503.5 84.83,10.23 v84.3,9.7 | R436.2 67.57,5.35 SW400.P$2 69.11,8.71 69.5,9.1 v69.5,9.9
  Bottom 0.2: v69.5,9.9 71.9,9.9 72.5,9.3 81.5,9.3 81.9,9.7 v84.3,9.7
CLK
  Top 0.2: J300.P$5 43.54,1.6 27.6,1.6 26.8,2.4 26.8,7.3 27.2,7.7 28.73,7.7 IC300.12
DAT  (via drill 0.3)
  Top 0.2: J300.P$4 45.3,6.7 44,5.4 44,4.3 42.9,3.2 v41.5,3.2 | v30.8,9 30.76,9.04 IC300.13
  Bottom 0.2: v41.5,3.2 35.7,9 v30.8,9
FOOT_SW1  (via drill 0.3)
  Top 0.2: J201.P$3 507.29,3.99 508.2,4.9 v508.5,4.9 | v527.5,5 527.8,5 528.4,4.4 528.4,3.25 J200.P$3
  Bottom 0.2: v508.5,4.9 509.3,4.1 518.3,4.1 518.8,4.6 527.1,4.6 v527.5,5
GND  (via drill 0.3, 0.6 pad 1.27)
  Top 0.2: J202.P$2 6.3,9.95 | LED300.P$1 v13,2.3 | C300.2 28.2,13 | 28.2,13 v29.8,13 | IC300.14 28.2,10.31 28.2,13 | R401.1 42.43,11.2 v44,11.2 | J300.P$3 50.12,2.2 v48.4,2.2 | v57.8,2.3 59.7,2.3 R433.1 R434.1 R435.1 65.15,2.43 R436.1 R432.1 70.35,2.48 R431.1 R430.1 75.63,2.4 v77.2,2.4 | LED200.P$1 32.9,12.9 v32.3,12.9 | IC503.8 84.44,14.04 83.5,13.1 83.5,6.42 | 83.5,6.42 83.5,2.95 | 83.5,2.95 C503.2 | IC503.15 83.5,6.42 | 83.5,2.95 83.5,2.5 v85,2.5 | R402.1 100.75,1.95 v100.7,1.9 | R403.1 142.5,2 v142.6,1.9 | R404.1 v166.4,1.9 | R405.1 207.75,1.95 v207.7,1.9 | v222.6,2.3 220.9,2.3 C502.2 222,3.5 222,13.1 222.59,13.7 IC502.8 | IC502.15 216.07,6.08 215.7,5.7 v215.7,2.4 | R406.1 v230.9,2 | R407.1 272.7,3.33 v272.7,1.8 | R408.1 305.2,3.68 v305.2,1.9 | R409.1 v362.7,1.9 | R410.1 403.25,2.25 v403.3,2.2 | R411.1 427.15,2.25 v427.1,2.2 | R412.1 467.25,1.85 v467.3,1.8 | IC501.8 544.75,13.74 544.1,13.1 C501.2 544.35,2.3 v545.9,2.3 | IC501.15 538.73,6.12 538.1,5.5 v538.1,2.2 | R413.1 v492.1,2 | J301.P$2 512.9,10.7 513.7,9.9 v513.7,2.3 | R414.1 v557.1,2.1 | R415.1 598.25,2.05 v598.2,2 | R416.1 v623.8,1.9 | R417.1 663.75,2.15 v663.8,2.1 | R418.1 688.45,2.15 v688.4,2.1 | R419.1 v729.2,2.1 | R420.1 762.25,2.15 v762.3,2.1 | R421.1 802.75,2.15 v802.8,2.1 | R422.1 861.25,2.15 v861.2,2.1 | R423.1 v887.5,2.1 | R424.1 928.25,2.25 v928.2,2.2 | C203.2 951.95,2.25 v951.9,2.2 | R425.1 957.5,2.2 v957.4,2.1 | v812.2,2.5 812.15,2.45 C500.2 811.1,2.9 811.1,12.8 | IC500.8 812.35,14.04 811.1,12.8 | IC500.15 809.23,6.42 v810,7.2 | IC500.10 807.85,12.8 811.1,12.8 | R437.1 19.48,13.7 21.7,13.7 v22.5,12.9
  Top 0.5: C200.2 475.75,2.15 v475.8,2.1 | C201.2 v479,2.1 | IC200.2 482.65,2.15 v482.7,2.1 | C202.2 486.65,2.15 v486.7,2.1 | 6.3,9.95 v6.3,12.7 | J302.P$2 J202.P$2 | J200.P$6 526.3,8.69 v526.3,5.6 526.25,5.55 J200.P$5 | v496.8,4.1 498.7,6 501.5,6 502.2,5.3 504.75,5.3 | J201.P$6 504.75,5.3 | 504.75,5.3 J201.P$5
  Bottom 0.2: v6.3,12.7 6.5,12.7 | v13,2.3 14.6,3.9 14.6,12.7 | v29.8,13 30.4,13 | v44,11.2 44,11.5 | v48.4,2.2 48.2,2.2 | v57.8,2.3 57.5,2.3 | 528.8,2.7 528.9,2.6 | v810,7.2 812.3,7.2 812.7,6.8 812.7,2.6
  Bottom 0.5: v475.8,2.1 476.7,2.1 | v479,2.1 479.3,2.1 | v482.7,2.1 483,2.1 | v486.7,2.1 487,2.1 | 528.8,2.7 528.8,5 527.9,5.9 526.6,5.9 v526.3,5.6 | v496.8,4.1 496.8,2.8 496.7,2.7
  pour Bottom (no thermals): 4.5,13.7 45,13.7 45,3 959.2,3 959.2,1 43,1 43,12 4.5,12
LAMP_GND  (via drill 0.3)
  Top 0.2: J200.P$4 v528.79,6.31 v528.8,6.3 | v506.6,5.6 507.29,6.29 J201.P$4
  Bottom 0.2: v528.8,6.3 528.5,6.6 523.9,6.6 522.9,5.6 509.6,5.6 509.1,6.1 507.1,6.1 v506.6,5.6
MIDI_TX
  Top 0.2: R302.1 18.22,8.08 21.7,4.6 22.2,4.6 22.8,4 23.56,4 IC300.6
N$1
  Top 0.2: LED200.P$2 37.43,11.45 R200.1
N$2
  Top 0.2: J302.P$1 8.79,9.79 10.2,11.2 15.23,11.2 R303.2
N$3
  Top 0.2: R300.2 15.13,5.17 LED300.P$2
N$4
  Top 0.2: IC300.7 18.81,2.69 R300.1
N$5  (via drill 0.3)
  Top 0.2: R302.2 v13.5,8.15 | J301.P$3 508.8,17.3 v507.1,15.6 | v3.7,9.6 v3.71,9.59 J302.P$3
  Bottom 0.2: v507.1,15.6 506.4,16.3 338.8,16.3 332.2,9.7 325.1,9.7 318.5,16.3 58.8,16.3 53.6,11.1 50.5,11.1 45.3,16.3 4.9,16.3 3.7,15.1 v3.7,9.6 12.05,9.6 v13.5,8.15
N$6
  Top 0.2: J301.P$1 513.8,17.3 510.4,13.9 R301.2
N$7  (via drill 0.3)
  Top 0.2: v803.4,16 803.4,14.13 R500.1 | IC500.9 807.7,14.04 v807.7,15.4
  Bottom 0.2: v807.7,15.4 805.9,15.4 805.3,16 v803.4,16
N$8
  Top 0.2: IC501.9 R501.1
N$9  (via drill 0.3)
  Top 0.2: v215.9,12.4 215.93,12.43 IC502.10 | R501.2 532,13.27 v532,11.3
  Bottom 0.2: v215.9,12.4 216.3,12.4 221,7.7 227,7.7 227.8,6.9 466.8,6.9 473.2,13.3 489,13.3 491.5,10.8 531.6,10.8 532,11.2 v532,11.3
N$10
  Top 0.2: IC300.10 30.63,5.23 31.6,6.2 R304.2
N$11
  Top 0.2: IC300.9 30.64,3.96 31.1,3.5 R305.2
N$12
  Top 0.2: IC502.9 216,13.7 215.28,14.42 R502.1
N$13  (via drill 0.3)
  Top 0.2: IC503.10 82.28,12.78 84.6,15.1 88.7,15.1 89.8,14 v89.8,7.8 | v213.2,7.5 213.2,11.53 R502.2
  Bottom 0.2: v89.8,7.8 89.8,7.7 90.6,6.9 212.6,6.9 v213.2,7.5
N$14  (via drill 0.3)
  Top 0.2: R500.2 800.48,7.52 v800.5,7.5 | IC501.10 542.08,12.47 v542.1,12.5
  Bottom 0.2: v800.5,7.5 552.6,7.5 547.6,12.5 v542.1,12.5
PED_01  (via drill 0.3)
  Top 0.2: R401.2 42.4,14.47 42.4,17.4 42.5,17.5 SW401.2 45.35,18.6 69.2,18.6 70.6,17.2 v70.6,15.4 | v84.5,11.5 IC503.6
  Bottom 0.2: v70.6,15.4 71.6,15.4 71.9,15.7 80.3,15.7 v84.5,11.5
PED_02  (via drill 0.3)
  Top 0.2: SW402.2 104.5,17.5 100.75,13.75 100.75,9.95 v100.8,9.9 100.75,9.85 R402.2 | IC502.11 217.87,11.1 v216,11.1
  Bottom 0.2: v100.8,9.9 102.5,11.6 215.5,11.6 v216,11.1
PED_03  (via drill 0.3)
  Top 0.2: R403.2 142.25,6.82 142.25,9.75 v142.1,9.9 142.25,10.05 SW403.2 | IC502.12 217.91,9.9 v216,9.9
  Bottom 0.2: v142.1,9.9 v216,9.9
PED_04  (via drill 0.3)
  Top 0.2: R404.2 v166.4,8.8 166.4,13.9 170,17.5 SW404.2 | IC502.13 216.19,8.62 v216,8.8
  Bottom 0.2: v216,8.8 215.7,9.1 168.4,9.1 168.1,8.8 v166.4,8.8
PED_05  (via drill 0.3)
  Top 0.2: R405.2 v207.75,8.2 SW405.2 | IC502.14 216.06,7.34 v216,7.4
  Bottom 0.2: v216,7.4 215.2,8.2 v207.75,8.2
PED_06
  Top 0.2: IC502.3 228.46,7.34 229.2,6.6 230.88,6.6 R406.2 230.9,15.1 233.3,17.5 SW406.2
PED_07  (via drill 0.3)
  Top 0.2: IC502.4 226.19,8.62 v226.2,8.6 | SW407.2 272.7,13.95 v272.7,8.6 272.65,8.55 R407.2
  Bottom 0.2: v226.2,8.6 v272.7,8.6
PED_08  (via drill 0.3)
  Top 0.2: IC502.5 226.19,9.88 v226.2,9.9 | R408.2 305.2,6.62 v305.2,9.9 305.25,9.95 SW408.2
  Bottom 0.2: v226.2,9.9 v305.2,9.9
PED_09  (via drill 0.3)
  Top 0.2: IC502.6 226.15,11.15 v226.2,11.1 | R409.2 v362.7,9 362.7,14.5 365.7,17.5 SW409.2
  Bottom 0.2: v362.7,9 362.6,9.1 322.1,9.1 320.1,11.1 v226.2,11.1
PED_10  (via drill 0.3)
  Top 0.2: IC501.11 537.79,11.21 v537.7,11.3 | v409,14.3 403.55,14.3 SW410.2 R410.2
  Bottom 0.2: v537.7,11.3 536.3,12.7 531.6,12.7 530.7,11.8 492.2,11.8 489.7,14.3 v409,14.3
PED_11  (via drill 0.3)
  Top 0.2: IC501.12 537.07,9.94 v535.8,11.2 | R411.2 427.15,8.65 v427.2,8.7 435.9,8.7 437,9.8 437,16.7 436.2,17.5 SW411.2
  Bottom 0.2: v535.8,11.2 534.9,12.1 531.8,12.1 531,11.3 491.9,11.3 489.4,13.8 473,13.8 467.9,8.7 v427.2,8.7
PED_12  (via drill 0.3)
  Top 0.2: IC501.13 537.37,8.66 v536.9,8.2 | v471.2,6.5 467.33,6.5 R412.2 SW412.2
  Bottom 0.2: v536.9,8.2 522.9,8.2 522,7.3 512,7.3 511.6,7.7 472.4,7.7 472.25,7.55 v471.2,6.5
PED_13  (via drill 0.3)
  Top 0.2: IC501.14 538.39,7.39 v537.6,6.6 | v493.9,6.5 493.82,6.42 R413.2 492.1,16.1 493.5,17.5 SW413.2
  Bottom 0.2: v537.6,6.6 532.3,6.6 531.3,7.6 523.2,7.6 522.2,6.6 511.8,6.6 511.3,7.1 502.7,7.1 502.1,6.5 v493.9,6.5
PED_14
  Top 0.2: SW414.2 560.4,17.5 557.1,14.2 R414.2 557.07,6.7 554.6,6.7 553.9,7.39 IC501.3
PED_15  (via drill 0.3)
  Top 0.2: IC501.4 554.34,8.66 v554.4,8.6 | SW415.2 598.2,13.95 v598.2,8.6 598.25,8.55 R415.2
  Bottom 0.2: v554.4,8.6 v598.2,8.6
PED_16  (via drill 0.3)
  Top 0.2: IC501.5 552.57,9.94 v552.6,9.9 | R416.2 623.7,6.82 v623.7,9.9 623.7,14.7 626.5,17.5 SW416.2
  Bottom 0.2: v552.6,9.9 v623.7,9.9
PED_17  (via drill 0.3)
  Top 0.2: IC501.6 551.29,11.21 v551.4,11.1 | R417.2 663.8,6.92 v663.8,11 663.75,11.05 SW417.2
  Bottom 0.2: v551.4,11.1 663.7,11.1 v663.8,11
PED_18  (via drill 0.3)
  Top 0.2: IC500.11 809.61,11.51 v810,11.9 | R418.2 688.5,6.72 v688.5,11.8 688.5,15.8 690.2,17.5 SW418.2
  Bottom 0.2: v810,11.9 800.7,11.9 798.5,9.7 765.2,9.7 763.1,11.8 v688.5,11.8
PED_19  (via drill 0.3)
  Top 0.2: IC500.12 809.63,10.23 v810,10.6 | R419.2 v729.2,10.5 729.25,10.55 SW419.2
  Bottom 0.2: v810,10.6 800.5,10.6 799,9.1 764.1,9.1 762.7,10.5 v729.2,10.5
PED_20  (via drill 0.3)
  Top 0.2: IC500.13 809.57,8.96 v810,9.4 | R420.2 762.3,6.92 v762.3,9.3 762.25,9.35 SW420.2
  Bottom 0.2: v810,9.4 800.3,9.4 799.3,8.4 763.2,8.4 v762.3,9.3
PED_21  (via drill 0.3)
  Top 0.2: R421.2 804.97,7.67 v805,7.7 | v810,8.3 809.39,7.7 IC500.14 | SW421.2 823.4,17.5 821.6,15.7 v821.6,8.4
  Bottom 0.2: v805,7.7 805.6,8.3 v810,8.3 821.5,8.3 v821.6,8.4
PED_22
  Top 0.2: IC500.3 816.5,7.7 817.58,6.62 R422.2 SW422.2
PED_23  (via drill 0.3)
  Top 0.2: IC500.4 817.66,8.96 v818.3,9.6 | R423.2 v887.5,9.6 887.5,14.8 890.2,17.5 SW423.2
  Bottom 0.2: v818.3,9.6 v887.5,9.6
PED_24  (via drill 0.3)
  Top 0.2: IC500.5 817.53,10.23 v818.3,11 | R424.2 928.2,6.77 v928.2,10.9 928.25,10.95 SW424.2
  Bottom 0.2: v818.3,11 928.1,11 v928.2,10.9
PED_25  (via drill 0.3)
  Top 0.2: IC500.6 817.4,11.51 v818.2,12.3 | R425.2 957.4,6.87 v957.4,12.3 957.4,15.3 958.6,16.5 960.25,16.5 SW425.2
  Bottom 0.2: v818.2,12.3 v957.4,12.3
PHOTO_DI_IN  (via drill 0.3)
  Top 0.2: 510.37,8.2 510.19,8.38 | 510.19,8.38 J201.P$2 | J200.P$2 531.3,8.71 v531.3,6.3 | v511,6.3 509.8,7.5 509.8,7.7 510.19,8.09 510.19,8.38
  Bottom 0.2: v531.3,6.3 530.5,7.1 523.6,7.1 522.6,6.1 511.2,6.1 v511,6.3
POLY_MONO  (via drill 0.3)
  Top 0.2: SW400.P$16 64.8,17.59 v61.8,14.6 | v47.1,12.6 46.7,13 40.9,13 39.8,11.9 v39.8,10.9 | v25.7,9 23.64,9 IC300.2 22.06,9.04 19.92,11.18 R437.2
  Bottom 0.2: v61.8,14.6 59,14.6 54.4,10 49.7,10 v47.1,12.6 | v39.8,10.9 27.6,10.9 v25.7,9
SER_CLK  (via drill 0.3)
  Top 0.2: v48.5,9.8 46.9,9.8 46,8.9 41,8.9 35.67,3.57 R305.1 | IC502.2 225.68,6.08 226,6.4 v227.1,6.4 | v552.9,6.4 548.7,6.4 548.4,6.1 546.4,6.1 IC501.2 | IC500.2 814,6.4 v811.9,6.4 | IC503.2 88.38,6.42 v88.4,6.4
  Bottom 0.2: v48.5,9.8 48.5,8.8 50.9,6.4 v88.4,6.4 v227.1,6.4 467,6.4 473.4,12.8 488.8,12.8 491.3,10.3 532.1,10.3 532.5,10.7 535,10.7 535.4,10.3 549,10.3 v552.9,6.4 v811.9,6.4
SER_DATA  (via drill 0.3)
  Top 0.2: IC300.8 30.61,2.69 31.1,2.2 36.8,2.2 38.7,4.1 43.1,4.1 43.6,4.6 43.6,5.8 46.8,9 v49.4,9 | v77.6,10.7 77.6,12.8 78.8,14 80.28,14 IC503.9
  Bottom 0.2: v77.6,10.7 57.4,10.7 55.7,9 v49.4,9
SER_SH  (via drill 0.3)
  Top 0.2: R304.1 38.82,9.4 45.8,9.4 v47,10.6 | v89,5.1 88.94,5.16 IC503.1 | v227.2,5.1 226.4,5.1 226.1,4.8 IC502.1 | v552.3,5.1 548.5,5.1 548.2,4.8 546.43,4.8 IC501.1 | 814.03,5.1 IC500.1 813.92,5.1 v811.9,5.1
  Bottom 0.2: v47,10.6 47,9.3 51.2,5.1 v89,5.1 v227.2,5.1 466.4,5.1 473.6,12.3 488.5,12.3 491,9.8 532.3,9.8 532.7,10.2 534.8,10.2 535.2,9.8 547.6,9.8 v552.3,5.1 v811.9,5.1
VPP  (via drill 0.3)
  Top 0.2: J300.P$1 53.1,3.1 51.4,4.8 51.4,8.3 48.4,11.3 46.7,11.3 45.3,9.9 v32.3,9.9 | v25.6,6.5 IC300.4
  Bottom 0.2: v32.3,9.9 29,9.9 v25.6,6.5

### Text on the board
Top: 1 | 1 | 2 | 6 | 11 | 13 | 14 | 16 | 18 | 20 | 21 | 23 | 25 | 1 | 4 | 8 | 9 | 3 | 5 | 7 | 10 | 12 | 15 | 17 | 19 | 22 | 24 | 1 | 1 | 1 | Pedalier / RS, FS, May 2015 / GPL v3 | 1 | 1